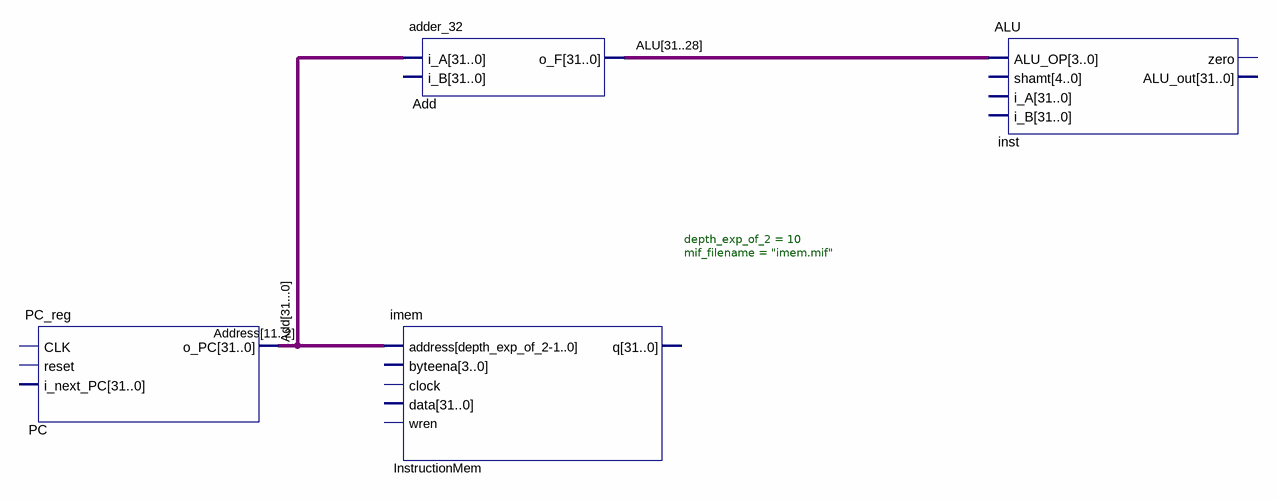
[diagram p0: schematic sheet]
// Quartus schematic singleCycleProcessor.bdf as structural Verilog: 4 symbols, 0 pins
module singleCycleProcessor (
);

  wire \Add[31...0] ;
  wire [11:2] Address;
  wire [31:28] ALU;

  PC_reg PC (.o_PC(Address));  // open: CLK, reset, i_next_PC
  adder_32 Add (.i_A({32{\Add[31...0] }}), .o_F(ALU));  // open: i_B
  imem #(.depth_exp_of_2(10), .mif_filename("imem.mif")) InstructionMem (.address(Address));  // open: byteena, clock, data, wren, q
  ALU inst (.ALU_OP(ALU));  // open: shamt, i_A, i_B, zero, ALU_out
endmodule
